# Altium schematic sheet POWER.SchDoc
size A4; SheetNumber: 5; SheetTotal: 7
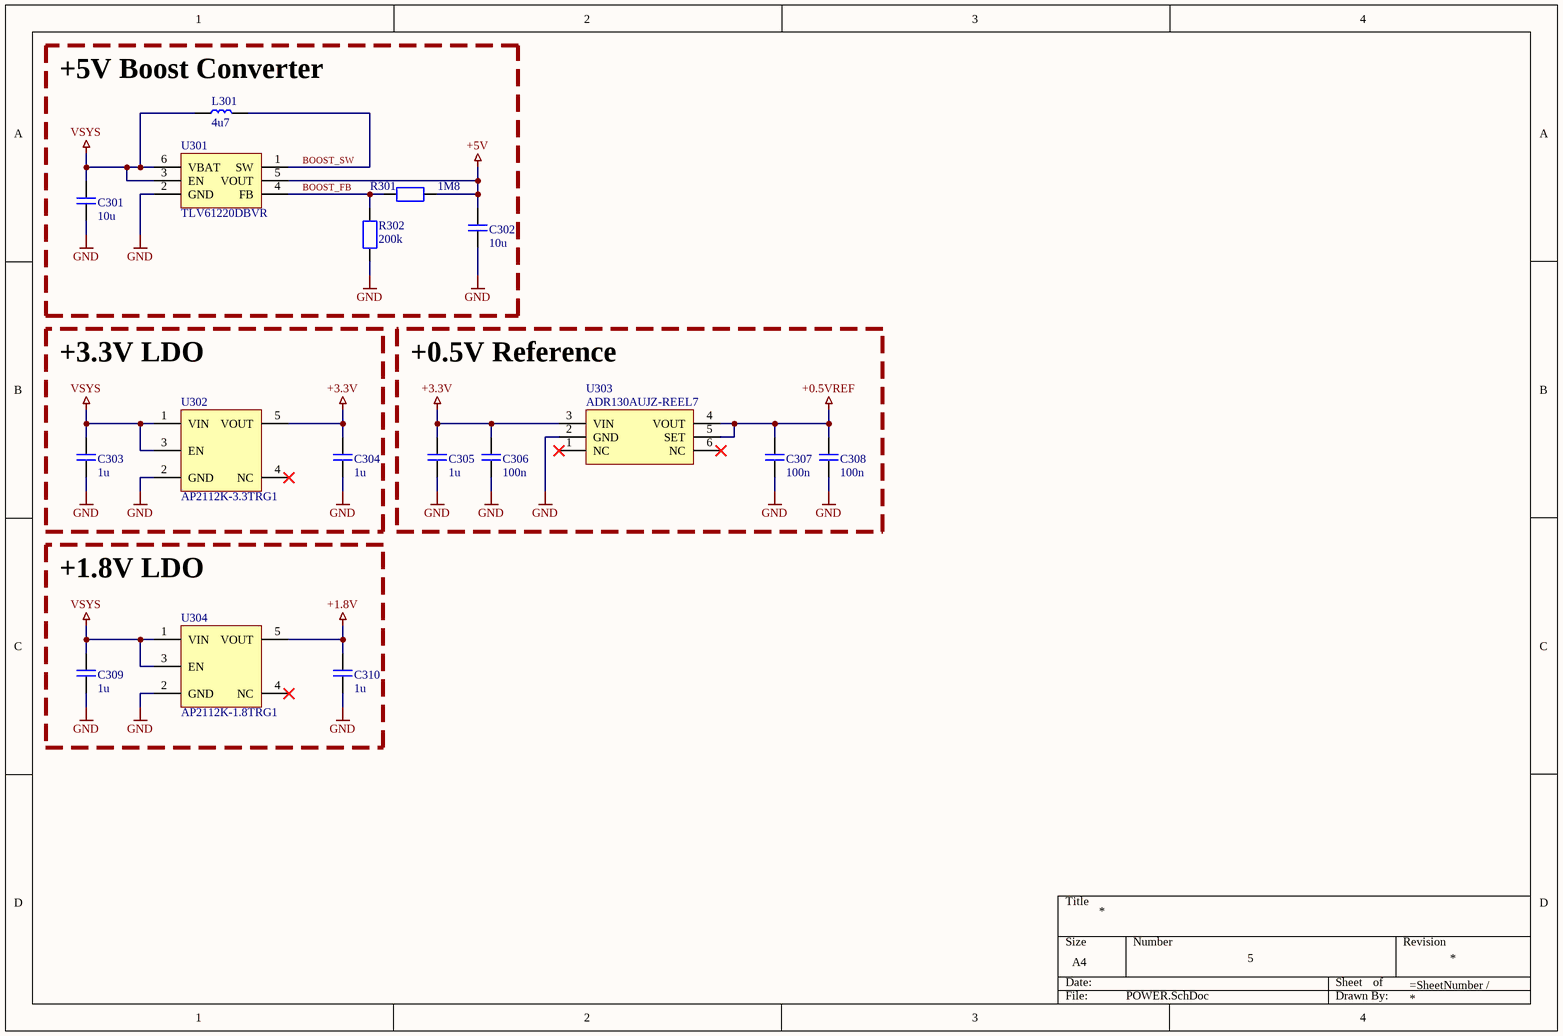
[diagram p0: POWER.SchDoc]

## Parts
C301  10u  [CAPC0603]
C302  10u  [CAPC0603]
C303  1u  [CAPC0603]
C304  1u  [CAPC0603]
C305  1u  [CAPC0603]
C306  100n  [CAPC0603]
C307  100n  [CAPC0603]
C308  100n  [CAPC0603]
C309  1u  [CAPC0603]
C310  1u  [CAPC0603]
L301  4u7  [INDC1007]
R301  1M8  [RESC0603]
R302  200k  [RESC0603]
U301  TLV61220DBVR  [SOT95P280X115-6]
U302  AP2112K-3.3TRG1  [SOT95P280X115-5]
U303  ADR130AUJZ-REEL7  [SOT95P280X115-6]
U304  AP2112K-1.8TRG1  [SOT95P280X115-5]

## Blocks framed on the sheet
+5V Boost Converter: C301 C302 L301 R301 R302 U301
+3.3V LDO: C303 C304 U302
+0.5V Reference: C305-C308 U303
+1.8V LDO: C309 C310 U304

## Nets
+0.5VREF: C307.2 C308.2 U303.4(VOUT) U303.5(SET)
+1.8V: C310.2 U304.5(VOUT)
+3.3V: C304.2 C305.2 C306.2 U302.5(VOUT) U303.3(VIN)
+5V: C302.2 R301.2 U301.5(VOUT)
GND: C301.1 C302.1 C303.1 C304.1 C305.1 C306.1 C307.1 C308.1 C309.1 C310.1 R302.1 U301.2(GND) U302.2(GND) U303.2(GND) U304.2(GND)
VSYS: C301.2 C303.2 C309.2 L301.1 U301.3(EN) U301.6(VBAT) U302.1(VIN) U302.3(EN) U304.1(VIN) U304.3(EN)
BOOST_FB: R301.1 R302.2 U301.4(FB)
BOOST_SW: L301.2 U301.1(SW)

Not connected (* = marked no-connect by the designer): U302 4(NC)*; U303 1(NC)* 6(NC)*; U304 4(NC)*

## Library data of the parts
C301 C302 = CAPC0603-10u-20: Ceramic capacitor, 10uF,  25V, X5R; MFR: TAIYO YUDEN; MFRN: TMK107BBJ106MA-T; SPN: 963-TMK107BBJ106MA-T; Checked: Yes; Footprint: 0603; Supplier: Mouser; Link: https://hr.mouser.com/ProductDetail/TAIYO-YUDEN/TMK107BBJ106MA-T?qs=lkMpTOwszhf2a50BCYsq8A%3D%3D
C303-C305 C309 C310 = CAPC0603-1u-10: Ceramic capacitor, 1uF,  50V, X5R; MFR: Murata Electronics; MFRN: GRT188R61H105KE13D; SPN: 81-GRT188R61H105KE3D; Checked: Yes; Footprint: 0603; Supplier: Mouser; Link: https://hr.mouser.com/ProductDetail/Murata-Electronics/GRT188R61H105KE13D?qs=drgMNd%252BkGPNIxxtJByMGCg%3D%3D
C306-C308 = CAPC0603-100n-10: Ceramic capacitor, 100nF,  50V, X7R; MFR: KEMET; MFRN: C0603C104K5RACAUTO; SPN: 80-C0603C104K5RAUTO; Checked: Yes; Footprint: 0603; Supplier: Mouser; Link: https://hr.mouser.com/ProductDetail/KEMET/C0603C104K5RACAUTO?qs=8xX%252BF9%252BWV6EZsgKw9G0PqQ%3D%3D
L301 = INDC1007-4u7-20: Inductor 4.7uH, 680mA, ±20%, 260mOhm; MFR: TAIYO YUDEN; MFRN: CBC2518T4R7M; SPN: 963-CBC2518T4R7M; Checked: Yes; Footprint: 1008; Supplier: Mouser; Link: https://hr.mouser.com/ProductDetail/TAIYO-YUDEN/CBC2518T4R7M?qs=sGAEpiMZZMv126LJFLh8y8CHgMb6WLnpfdgzSjZMuh8%3D
R301 = RES0603-1M8-1: Thick film resistor, 1.8MOhms, 100mW; MFR: Vishay / Dale; MFRN: CRCW06031M80FKEAC; SPN: 71-CRCW06031M80FKEAC; Checked: Yes; Footprint: 0603; Supplier: Mouser; Link: https://hr.mouser.com/ProductDetail/Vishay-Dale/CRCW06031M80FKEAC?qs=sGAEpiMZZMtlubZbdhIBIEVnJA25NYWZ%2FYivauIjUrk%3D
R302 = RES0603-200k-1: Thick film resistor, 200kOhms, 100mW; MFR: YAGEO; MFRN: RC0603FR-07200KL; SPN: 603-RC0603FR-07200KL; Checked: Yes; Footprint: 0603; Supplier: Mouser; Link: https://hr.mouser.com/ProductDetail/YAGEO/RC0603FR-07200KL?qs=sGAEpiMZZMtlubZbdhIBIPpBVm91En7n1EStA3IWCIA%3D
U301 = BOOST TLV61220DBVR: Boost converter, 0.7V to 5.5V Input; MFR: Texas Instruments; SPN: 595-TLV61220DBVR; Checked: No; Footprint: SOT-23; Supplier: Mouser; MFRN: TLV61220DBVR; Link: https://hr.mouser.com/ProductDetail/Texas-Instruments/TLV61220DBVR?qs=l6ZoeTYLMwOr7SC1DbpfZQ%3D%3D
U302 = IC REG LINEAR AP2112K-3.3TRG1: Linear LDO Voltage Regulator, 3.3V, 600mA; MFR: Diodes Incorporated; SPN: 621-AP2112K-3.3TRG1; Checked: Yes; Footprint: SOT-25-5; Supplier: Mouser; MFRN: AP2112K-3.3TRG1; Link: https://hr.mouser.com/ProductDetail/Diodes-Incorporated/AP2112K-3.3TRG1?qs=sGAEpiMZZMug9GoBKXZ7571prORexT17l%252BdJyLTK7uthQsHsGnYZAw%3D%3D
U303 = IC VREF ADR130AUJZ-REEL7: Voltage reference, 0.5V or 1V; MFR: Analog Devices; SPN: 584-ADR130AUJZ-R7; Checked: No; Footprint: TSOT-6; Supplier: Mouser; MFRN: ADR130AUJZ-REEL7; Link: https://hr.mouser.com/ProductDetail/Analog-Devices/ADR130AUJZ-REEL7?qs=WIvQP4zGangoCvzzhVb1kQ%3D%3D
U304 = IC REG LINEAR AP2112K-1.8TRG1: Linear LDO Voltage Regulator, 1.8V, 600mA; MFR: Diodes Incorporated; SPN: 621-AP2112K-1.8TRG1; Checked: Yes; Footprint: SOT-25-5; Supplier: Mouser; MFRN: AP2112K-1.8TRG1; Link: https://hr.mouser.com/ProductDetail/Diodes-Incorporated/AP2112K-1.8TRG1?qs=x6A8l6qLYDBx1xhw8AX2cw%3D%3D